# Altium schematic sheet WIFI_ESP8285_ESP8266.SchDoc
size A3; SheetNumber: 25; SheetTotal: 27
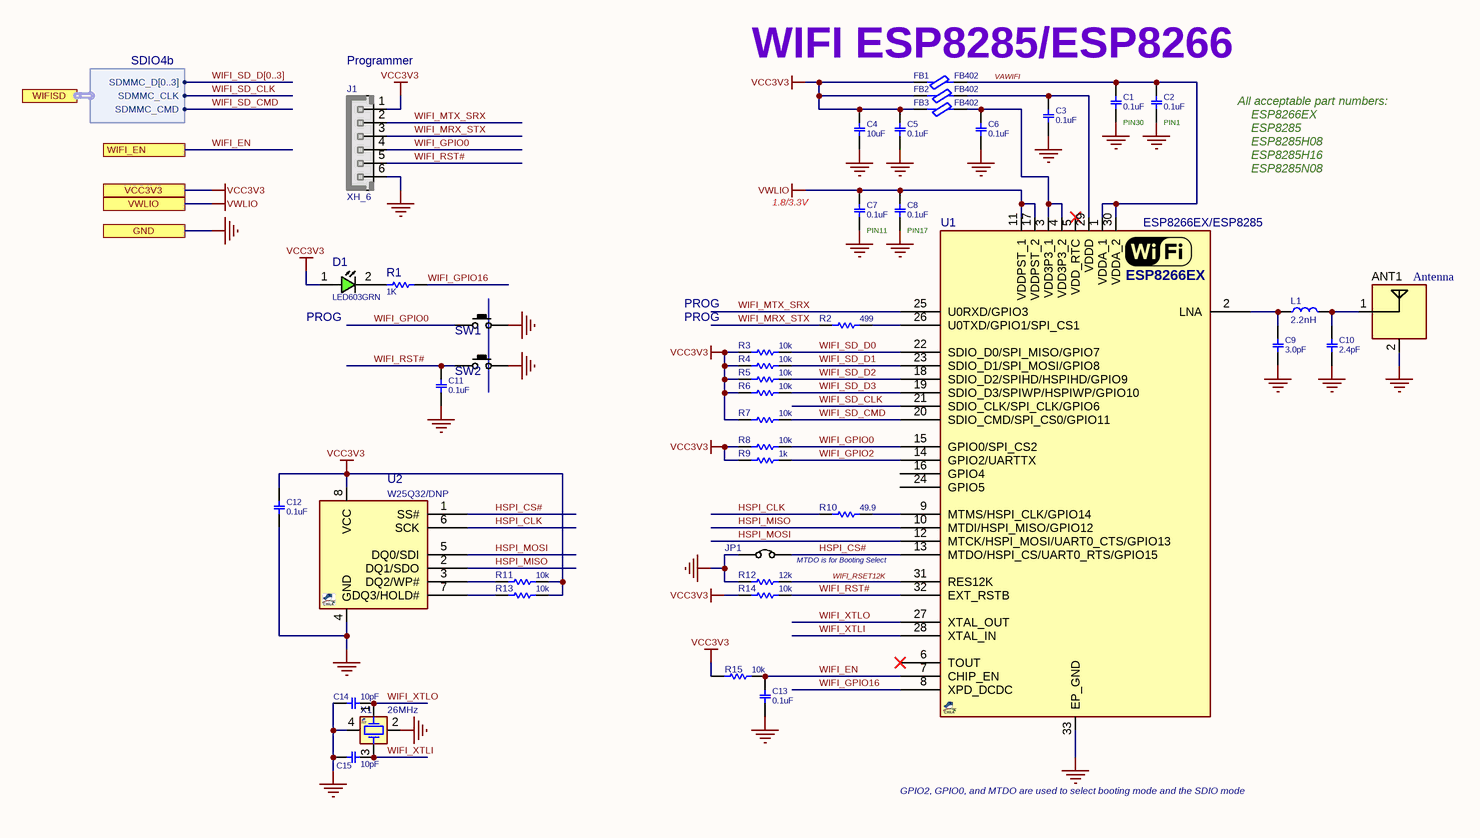
[diagram p0: WIFI_ESP8285_ESP8266.SchDoc]

## Parts
ANT1  Antenna  [ANT_PCB_2P4G_IFA]  (net tie, no BOM)
C1  0.1uF  [C0402]
C2  0.1uF  [C0402]
C3  0.1uF  [C0402]
C4  10uF  [C0402]
C5  0.1uF  [C0402]
C6  0.1uF  [C0402]
C7  0.1uF  [C0402]
C8  0.1uF  [C0402]
C9  3.0pF  [C0402]
C10  2.4pF  [C0402]
C11  0.1uF  [C0402]
C12  0.1uF  [C0402]
C13  0.1uF  [C0402]
C14  10pF  [C0402]
C15  10pF  [C0402]
D1  LED603GRN  [LED0603]
FB1  FB402  [L0402]
FB2  FB402  [L0402]
FB3  FB402  [L0402]
J1  XH_6  [XH_6]
JP1  JMPHDR2PIN  [JP_2_BLK]  (value not drawn)
L1  2.2nH  [L0402]
R1  1K  [R0402]
R2  499  [R0402]
R3  10k  [R0402]
R4  10k  [R0402]
R5  10k  [R0402]
R6  10k  [R0402]
R7  10k  [R0402]
R8  10k  [R0402]
R9  1k  [R0402]
R10  49.9  [R0402]
R11  10k  [R0402]
R12  12k  [R0402]
R13  10k  [R0402]
R14  10k  [R0402]
R15  10k  [R0402]
SW1  PUSHBUTTON  [SWPBS_SPST_3X2X1]  (value not drawn)
SW2  PUSHBUTTON  [SWPBS_SPST_3X2X1]  (value not drawn)
U1  ESP8266EX/ESP8285  [QFN50_32T]
U2  W25Q32/DNP  [SO_8_W]
X1  26MHz  [XTL_4_2016]

## Ports
GND, VCC3V3, VWLIO, WIFI_EN, WIFISD (harness SDIO4b)

## Harnesses
SDIO4b: SDMMC_CMD, SDMMC_D[0..3], SDMMC_CLK

## Nets
GND: ANT1.2(RETURN) C1.2 C2.2 C3.2 C4.1 C5.1 C6.2 C7.2 C8.2 C9.1 C10.1 C11.1 C12.2 C13.2 C14.1 C15.1 J1.6 JP1.1 R12.1 SW1.2(P3) SW2.2(P3) U1.33(EP_GND) U2.4(GND) X1.2 X1.4 ; port GND
VCC3V3: C4.2 C5.2 C12.1 D1.1(ANODE) FB1.1 FB2.2 FB3.2 J1.1 R3.1 R4.1 R5.1 R6.1 R7.1 R8.1 R9.1 R11.2 R13.2 R14.1 R15.1 U2.8(VCC) ; port VCC3V3
VWLIO: C7.1 C8.1 U1.11(VDDPST_1) U1.17(VDDPST_2) ; port VWLIO
HSPI_CLK: R10.1 U2.6(SCK)
HSPI_CS#: JP1.2 U1.13(MTDO/HSPI_CS/UART0_RTS/GPIO15) U2.1(SS#)
HSPI_MISO: U1.10(MTDI/HSPI_MISO/GPIO12) U2.2(DQ1/SDO)
HSPI_MOSI: U1.12(MTCK/HSPI_MOSI/UART0_CTS/GPIO13) U2.5(DQ0/SDI)
VAWIFI: C1.1 C2.1 FB1.2 U1.1(VDDA_1) U1.30(VDDA_2)
WIFI_EN: C13.1 R15.2 U1.7(CHIP_EN) ; port WIFI_EN
WIFI_GPIO0: J1.4 R8.2 SW1.1(P1) U1.15(GPIO0/SPI_CS2)
WIFI_GPIO2: R9.2 U1.14(GPIO2/UARTTX)
WIFI_GPIO16: R1.2 U1.8(XPD_DCDC)
WIFI_MRX_STX: J1.3 R2.1
WIFI_MTX_SRX: J1.2 U1.25(U0RXD/GPIO3)
WIFI_RSET12K: R12.2 U1.31(RES12K)
WIFI_RST#: C11.2 J1.5 R14.2 SW2.1(P1) U1.32(EXT_RSTB)
WIFI_SD_CLK: U1.21(SDIO_CLK/SPI_CLK/GPIO6) ; port WIFISD.SDMMC_CLK
WIFI_SD_CMD: R7.2 U1.20(SDIO_CMD/SPI_CS0/GPIO11) ; port WIFISD.SDMMC_CMD
WIFI_SD_D0: R3.2 U1.22(SDIO_D0/SPI_MISO/GPIO7)
WIFI_SD_D1: R4.2 U1.23(SDIO_D1/SPI_MOSI/GPIO8)
WIFI_SD_D2: R5.2 U1.18(SDIO_D2/SPIHD/HSPIHD/GPIO9)
WIFI_SD_D3: R6.2 U1.19(SDIO_D3/SPIWP/HSPIWP/GPIO10)
WIFI_XTLI: C15.2 U1.28(XTAL_IN) X1.3
WIFI_XTLO: C14.2 U1.27(XTAL_OUT) X1.1
NetANT1_1: ANT1.1(FEEDER) C10.2 L1.1
NetC3_1: C3.1 FB2.1 U1.29(VDDD)
NetC6_1: C6.1 FB3.1 U1.3(VDD3P3_1) U1.4(VDD3P3_2)
NetC9_2: C9.2 L1.2 U1.2(LNA)
NetD1_2: D1.2(CATHODE) R1.1
NetR2_2: R2.2 U1.26(U0TXD/GPIO1/SPI_CS1)
NetR10_2: R10.2 U1.9(MTMS/HSPI_CLK/GPIO14)
NetR11_1: R11.1 U2.3(DQ2/WP#)
NetR13_1: R13.1 U2.7(DQ3/HOLD#)

Not connected (* = marked no-connect by the designer): U1 5(VDD_RTC)* 6(TOUT)* 16(GPIO4) 24(GPIO5)

## Buses and harness runs
bus WIFI_SD_D[0..3]

## Notes on the sheet
- FPGA - WIFI
- (near J1) Programmer
- (near FB1) WIFI ESP8285/ESP8266
- PIN30
- (near C2) PIN1
- All acceptable part numbers:
- ESP8266EX
- ESP8285
- ESP8285H08
- ESP8285H16
- ESP8285N08
- (near C7) 1.8/3.3V
- PIN11
- PIN17
- (near D1) PROG
- PROG
- MTDO is for Booting Select
- GPIO2, GPIO0, and MTDO are used to select booting mode and the SDIO mode
- THIS DOCUMENT AND THE DATA DISCLOSED HEREIN OR
- HEREWITH IS THE PROPERTY OF ALTIUM LIMITED AND MAY
- DWG NO:
- REVISION
- REV:
- DESCRIPTION
- DATE
- APPROVED
- BE FREELY DISTRIBUTED IN WHOLE. NO RIGHTS ARE
- RESERVED OR EXPRESS OR IMPLIED WARANTEE GIVEN.
- ENG:
- APPROVALS
- PROJECT
- DSN:
- CHK:
- REFERENCE DOCUMENTS
- PROJECT REVISION:
- TITLE
- DOCUMENT REVISION:
- DESIGN ITEM:
- BOM:
- FAB DWG:
- PCB DWG:
- ASSY DWG:
- SCALE:
- A3
- SIZE
- CAGE CODE
- FILE NAME
- DWG NO.
- SHEET
- OF
- REV

## Library data of the parts
ANT1 = ANT_PCB_2P4G_IFA: Antenna,Microstrip, 2.4GHz; MANF: MANF; MANF_P#: MANF_P#; VALUE: Antenna
C1-C10 C12 C13 = CAP_SMD_MLCC_100n50T: CAP, MLCC; PARAM: 100V; MANF: -; PARAM2: -; ASSEMBLY: ASSEMBLY; PRICE: 100= 5$; MANF_P#: -
  C1-C3 C5-C8 C12 C13: VALUE: 0.1uF
  C4: VALUE: 10uF
  C9: VALUE: 3.0pF
  C10: VALUE: 2.4pF
C11 C14 C15 = CAP_SMD_MLCC_1: CAP, 100nF, 6.3V, C0G,  0402; PARAM: 50V; DESC: CAP, MLCC, 1nF, 50V, C0G, 10%, 0402; MANF_P#: MANF_PART#; MANF: Murata; PARAM2: C0G, 10%; PRICE: 100= 1$; ASSEMBLY: ASSEMBLY
  C11: VALUE: 0.1uF
  C14 C15: VALUE: 10pF
D1 = LED_SMD_0603_GRN: LED, SMD, 0603, GREEN; PARAM: 20mA; MANF: Kingbright; DESC: DESCRIPTION; MANF_P#: APT1608SGC; PARAM2: 2.2V; ASSEMBLY: ASSEMBLY; PRICE: 1: 0.14$, 100: 6.8$; VALUE: LED603GRN
FB1-FB3 = FBEAD_SMD_BLM15PD121: FERRITE_Bead, 0402, 0.5A, 200mOhm, 120@100MHz; MANF: MURATA; MANF_P#: BLM15AG121SN1D; PARAM: 120@100MHz; PARAM2: 0.5A, 200mOhm; VALUE: FB402
J1 = XH_6: JST-XH pitch: 2.5mm; MANF_P#: JST-S6B-XHA; MANF: JST; VALUE: XH_6
JP1 = JUMPER_HDR_2P: JUMPER, HEADER 2PIN; MANF: MANF; MANF_P#: MANF_P#; VALUE: JMPHDR2PIN
L1 = IND_SMD: INDUCTOR, SMD; VALUE: 2.2nH
R1 = RES_SMD: RESISTOR, SMD; MANF_P#: RK73H1ETTP4701F; MANF: KOA SPEER; PARAM: 0.063W; DESC: DESCRIPTION; DIST#: MOUSER; PARAM2: 1%; ASSEMBLY: ASSEMBLY; PRICE: 100= 0.5$; VALUE: 1K
R2-R15 = RES_SMD_10K_0402: RESISTOR, SMD; PARAM: 0.063W; DESC: DESCRIPTION; PARAM2: 1%; MANF: -; ASSEMBLY: ASSEMBLY; PRICE: 100= 0.3$; DIST#: -; MANF_P#: -
  R2: VALUE: 499
  R3-R8 R11 R13-R15: VALUE: 10k
  R9: VALUE: 1k
  R10: VALUE: 49.9
  R12: VALUE: 12k
SW1 SW2 = SWPBS_SPST_3X2_B3U-1000P: SWITCH, PUSH BUTTON, TACTILE, SMD, SPST, 3X2.5X1.2mm; MANF: OMRON; DESC: DESCRIPTION; VALUE: PUSHBUTTON; ASSEMBLY: ASSEMBLY; PARAM: PARAM; PRICE: 1$; MANF_P#: B3U-1000P
U1 = ESP8266EX_QFN32: ESP8266EX, RF SoC; MANF: Espressif Systems; PARAM2: 2.5~3.6v, 1.8~3.6v; MANF_P#: ESP8266EX; PRICE: 1.6$; VALUE: ESP8266EX/ESP8285
U2 = W25Q64FV_SO8W: SPI FLASH Memory, 64Mb (8M x8), 104MHz; MANF: WINBOND; MANF_P#: W25Q32JVSSIQ; PARAM2: 2.7~3.6V; PARAM: 32Mb (4M x8), 104MHz; PRICE: 10t@JAVAN; VALUE: W25Q32/DNP
X1 = XTL_4_26MHz_2016: Crystal 26MHz; MANF: MURATA; MANF_P#: XRCGB26M000F1H00R0; PARAM2: 10ppm; PARAM: 6pF; PRICE: 1= 0.5$; VALUE: 26MHz